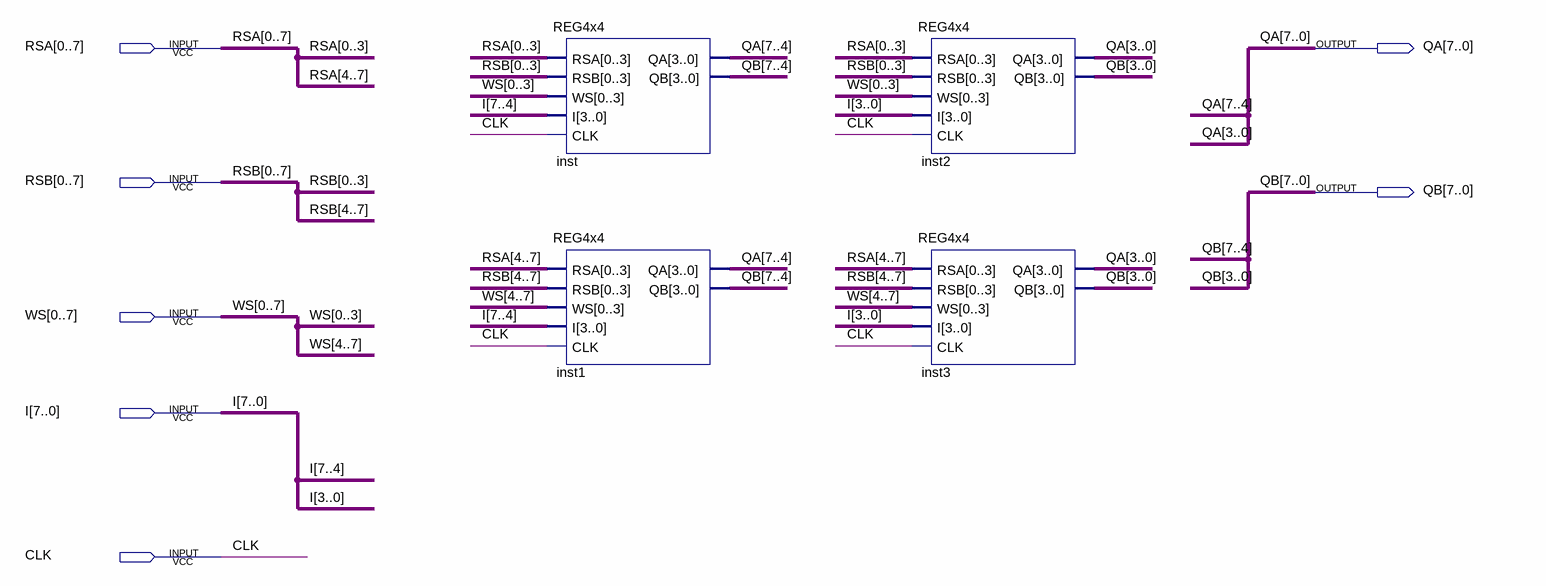
[diagram p0: schematic sheet]
// Quartus schematic REG8x8.bdf as structural Verilog: 4 symbols, 7 pins
module REG8x8 (
  input  [0:7] RSA,
  input  [0:7] RSB,
  input  [0:7] WS,
  input  [7:0] I,
  input  CLK,
  output [7:0] QA,
  output [7:0] QB
);

  REG4x4 inst (.RSA(RSA[0:3]), .RSB(RSB[0:3]), .WS(WS[0:3]), .I(I[7:4]), .CLK(CLK), .QA(QA[7:4]), .QB(QB[7:4]));
  REG4x4 inst1 (.RSA(RSA[4:7]), .RSB(RSB[4:7]), .WS(WS[4:7]), .I(I[7:4]), .CLK(CLK), .QA(QA[7:4]), .QB(QB[7:4]));
  REG4x4 inst2 (.RSA(RSA[0:3]), .RSB(RSB[0:3]), .WS(WS[0:3]), .I(I[3:0]), .CLK(CLK), .QA(QA[3:0]), .QB(QB[3:0]));
  REG4x4 inst3 (.RSA(RSA[4:7]), .RSB(RSB[4:7]), .WS(WS[4:7]), .I(I[3:0]), .CLK(CLK), .QA(QA[3:0]), .QB(QB[3:0]));
endmodule
